# EasyEDA Pro project SCH_DengFOC V3 pro.epro

# Schematic DengFOC V3 pro_2
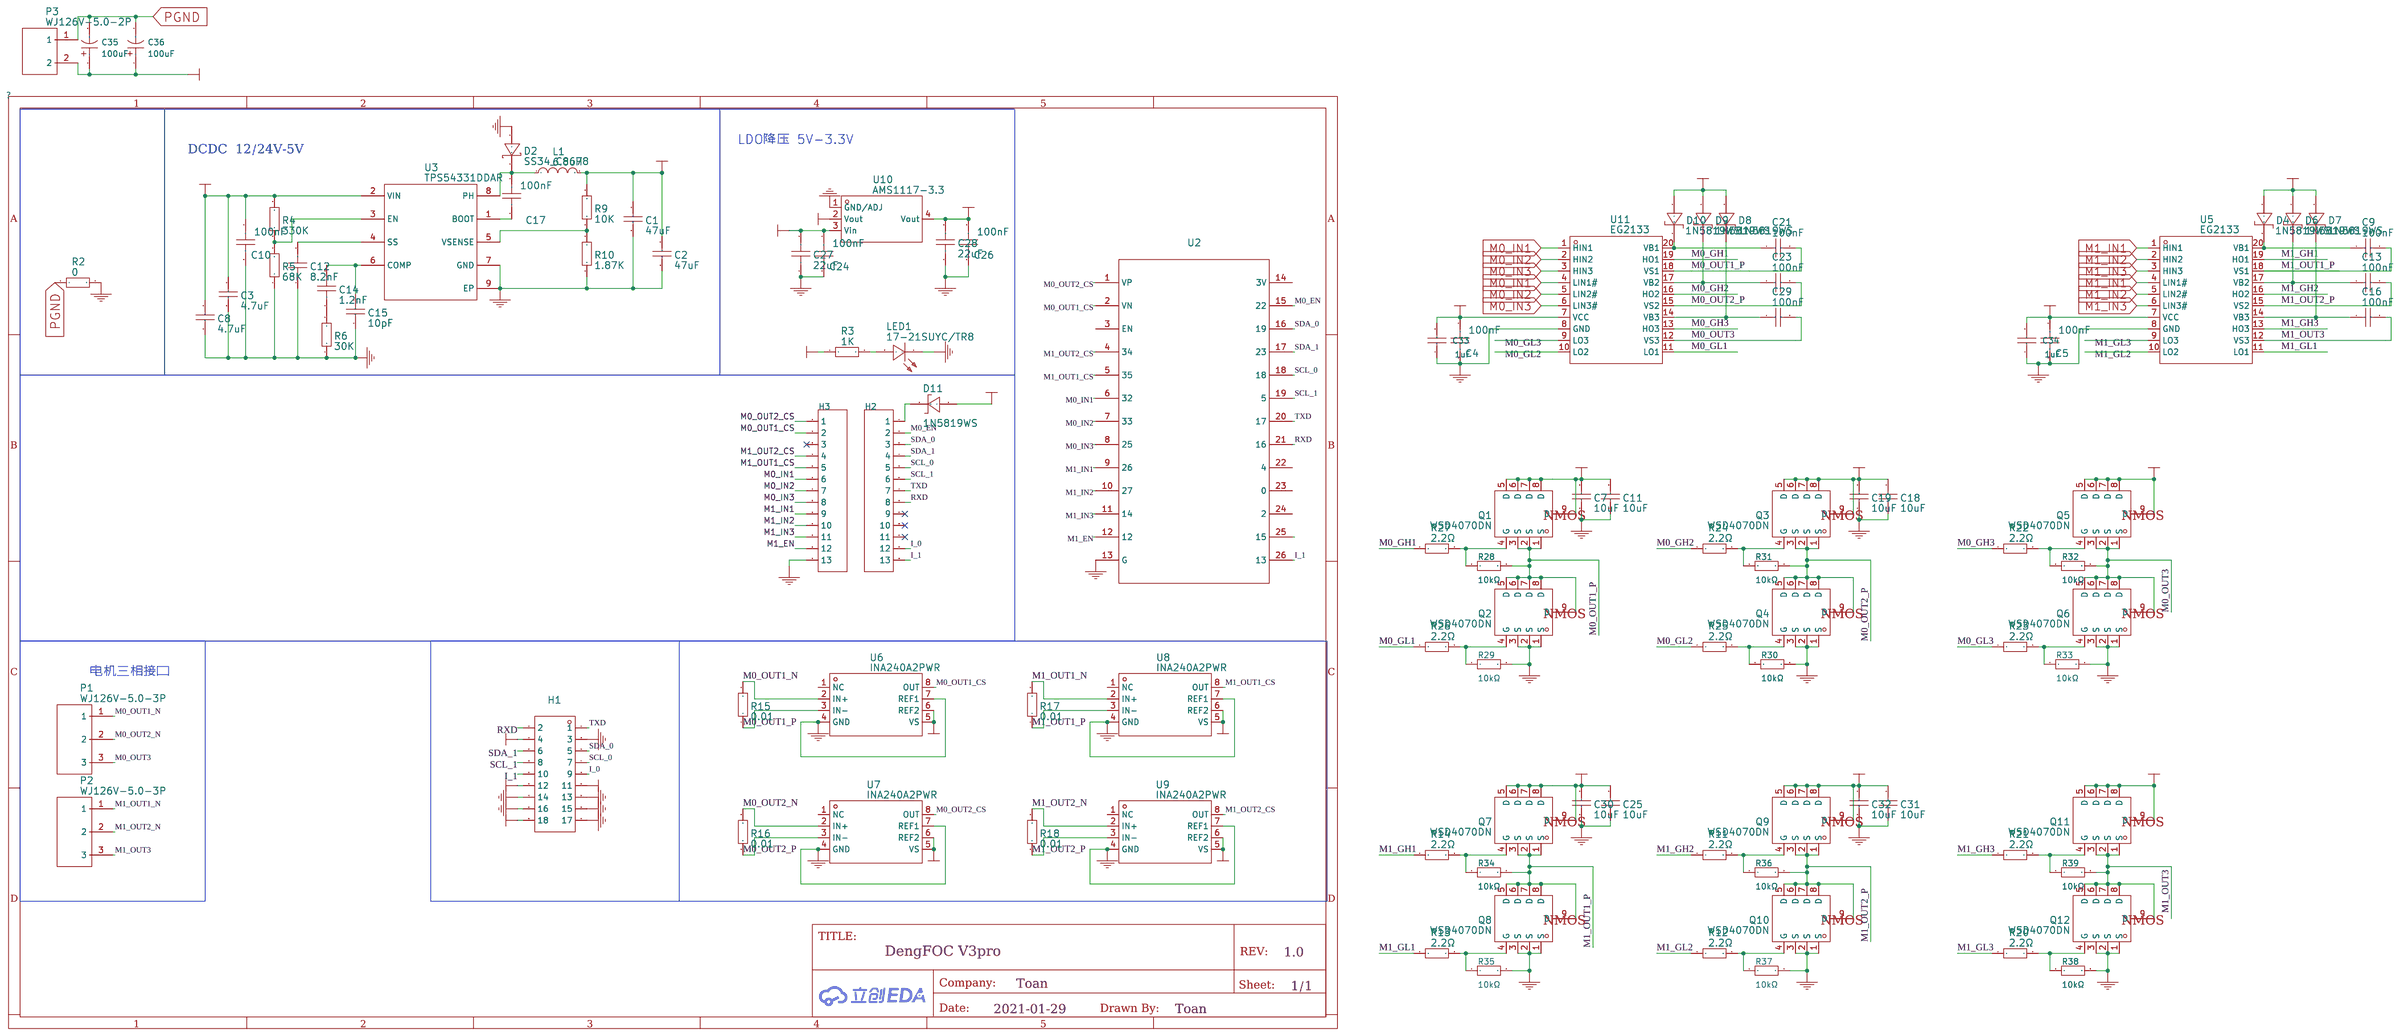
[diagram p0: schematic sheet]

## Parts
C1  47uF  [0603]
C2  47uF  [0603]
C3  4.7uF  [0805]
C4  100nF  [0603]
C5  100nF  [0603]
C7  10uF  [0805]
C8  4.7uF  [0805]
C9  100nF  [0402]
C10  100nF  [0603]
C11  10uF  [0805]
C12  8.2nF  [0603]
C13  100nF  [0402]
C14  1.2nF  [0603]
C15  10pF  [0603]
C16  100nF  [0402]
C17  100nF  [0603]
C18  10uF  [0805]
C19  10uF  [0805]
C21  100nF  [0402]
C23  100nF  [0402]
C24  100nF  [0603]
C25  10uF  [0805]
C26  100nF  [0603]
C27  22uF  [0603]
C28  22uF  [0603]
C29  100nF  [0402]
C30  10uF  [0805]
C31  10uF  [0805]
C32  10uF  [0805]
C33  1uF  [0603]
C34  1uF  [0603]
C35  100uF  [CAP-SMD_BD6.3-L6.6-W6.6-LS7.4-FD]
C36  100uF  [CAP-SMD_BD6.3-L6.6-W6.6-LS7.4-FD]
D2  SS34_C8678  [DO-214AC_L4.3-W2.7-LS5.3-RD]
D4  1N5819WS  [SOD-323_L1.8-W1.3-LS2.5-RD]
D6  1N5819WS  [SOD-323_L1.8-W1.3-LS2.5-RD]
D7  1N5819WS  [SOD-323_L1.8-W1.3-LS2.5-RD]
D8  1N5819WS  [SOD-323_L1.8-W1.3-LS2.5-RD]
D9  1N5819WS  [SOD-323_L1.8-W1.3-LS2.5-RD]
D10  1N5819WS  [SOD-323_L1.8-W1.3-LS2.5-RD]
D11  1N5819WS  [SOD-323_L1.8-W1.3-LS2.5-RD]
H1  Header-Female-2.54_2x9  [HDR-TH_18P-P2.54-V-R2-C9-S2.54]
H2  -  [SMD,P=2.54mm(交错脚)]
H3  -  [SMD,P=2.54mm(交错脚)]
L1  6.8uH  [IND-SMD_L5.0-W5.0_SWPA5040S]
LED1  17-21SUYC/TR8  [LED0805-RD]
P1  WJ126V-5.0-3P  [CONN-TH_3P-P5.00_WJ126V-5.0-3P]
P2  WJ126V-5.0-3P  [CONN-TH_3P-P5.00_WJ126V-5.0-3P]
P3  WJ126V-5.0-2P  [CONN-TH_WJ126V-5.0-2P]
Q1  WSD4070DN  [PDFN3333-8_L3.1-W3.2-P0.65-LS3.4-BL]
Q2  WSD4070DN  [PDFN3333-8_L3.1-W3.2-P0.65-LS3.4-BL]
Q3  WSD4070DN  [PDFN3333-8_L3.1-W3.2-P0.65-LS3.4-BL]
Q4  WSD4070DN  [PDFN3333-8_L3.1-W3.2-P0.65-LS3.4-BL]
Q5  WSD4070DN  [PDFN3333-8_L3.1-W3.2-P0.65-LS3.4-BL]
Q6  WSD4070DN  [PDFN3333-8_L3.1-W3.2-P0.65-LS3.4-BL]
Q7  WSD4070DN  [PDFN3333-8_L3.1-W3.2-P0.65-LS3.4-BL]
Q8  WSD4070DN  [PDFN3333-8_L3.1-W3.2-P0.65-LS3.4-BL]
Q9  WSD4070DN  [PDFN3333-8_L3.1-W3.2-P0.65-LS3.4-BL]
Q10  WSD4070DN  [PDFN3333-8_L3.1-W3.2-P0.65-LS3.4-BL]
Q11  WSD4070DN  [PDFN3333-8_L3.1-W3.2-P0.65-LS3.4-BL]
Q12  WSD4070DN  [PDFN3333-8_L3.1-W3.2-P0.65-LS3.4-BL]
R2  0  [0805]
R3  1K  [0805]
R4  330K  [0603]
R5  68K  [0603]
R6  30K  [0603]
R9  10K  [0603]
R10  1.87K  [0603]
R11  2.2Ω  [0402]
R12  2.2Ω  [0402]
R13  2.2Ω  [0402]
R14  2.2Ω  [0402]
R15  0.01  [R1206]
R16  0.01  [R1206]
R17  0.01  [R1206]
R18  0.01  [R1206]
R20  2.2Ω  [0402]
R21  2.2Ω  [0402]
R22  2.2Ω  [0402]
R23  2.2Ω  [0402]
R24  2.2Ω  [0402]
R25  2.2Ω  [0402]
R26  2.2Ω  [0402]
R27  2.2Ω  [0402]
R28  10kΩ  [R0402]
R29  10kΩ  [R0402]
R30  10kΩ  [R0402]
R31  10kΩ  [R0402]
R32  10kΩ  [R0402]
R33  10kΩ  [R0402]
R34  10kΩ  [R0402]
R35  10kΩ  [R0402]
R36  10kΩ  [R0402]
R37  10kΩ  [R0402]
R38  10kΩ  [R0402]
R39  10kΩ  [R0402]
U2  micropython esp32  [MICROPYTHON ESP32]
U3  TPS54331DDAR  [SOIC-8_L5.0-W4.0-P1.27-LS6.0-BL-EP]
U5  EG2133  [TSSOP-20_L6.5-W4.4-P0.65-LS6.4-BL]
U6  INA240A2PWR  [TSSOP-8_L4.4-W3.0-P0.65-LS6.4-BL]
U7  INA240A2PWR  [TSSOP-8_L4.4-W3.0-P0.65-LS6.4-BL]
U8  INA240A2PWR  [TSSOP-8_L4.4-W3.0-P0.65-LS6.4-BL]
U9  INA240A2PWR  [TSSOP-8_L4.4-W3.0-P0.65-LS6.4-BL]
U10  AMS1117-3.3  [SOT-223-4_L6.5-W3.5-P2.30-LS7.0-BR]
U11  EG2133  [TSSOP-20_L6.5-W4.4-P0.65-LS6.4-BL]

## Library data of the parts
C1 C2 = GRM188R60J476ME15D: Supplier: LCSC; Manufacturer: MuRata; Supplier Part: C140782; JLCPCB Part Class: Extended Part
C3 C8 = CL21A475KBQNNNE: Supplier: LCSC; Manufacturer: SAMSUNG; Supplier Part: C98192; JLCPCB Part Class: Extended Part
C4 C5 C10 C17 C24 C26 = CC0603KRX7R9BB104: Supplier: LCSC; Manufacturer: YAGEO; Supplier Part: C14663; JLCPCB Part Class: Basic; JLCPCB SMD: Yes
C7 C11 C18 C19 C25 C30-C32 = CL21A106KAYNNNE: Supplier: LCSC; Manufacturer: SAMSUNG; Supplier Part: C15850; JLCPCB Part Class: Basic Part
C9 C13 C16 C21 C23 C29 = CL05B104KO5NNNC: Supplier: LCSC; Manufacturer: SAMSUNG; Supplier Part: C1525; JLCPCB Part Class: Basic Part
C12 = CL10B822KB8NNNC: Supplier: LCSC; Manufacturer: SAMSUNG; Supplier Part: C27920; Paste Type: base
C14 = FN18X122K500PSG: Supplier: LCSC; Supplier Part: C565591; Manufacturer: PSA(Prosperity Dielectrics)
C15 = CC0603JRNPO9BN100: Supplier: LCSC; Manufacturer: YAGEO; Supplier Part: C106245; JLCPCB Part Class: Extended Part
C27 C28 = CL10A226MQ8NRNC: Supplier: LCSC; Manufacturer: SAMSUNG; Supplier Part: C59461; Paste Type: base
C33 C34 = CL10A105KB8NNNC: 容值:1uF;精度:±10%;额定电压:50V;材质(温度系数):X5R;; LCSC Part Name: 1uF ±10% 50V; Supplier Part: C15849; Manufacturer: SAMSUNG(三星); JLCPCB Part Class: 基础库; Datasheet: https://atta.szlcsc.com/upload/public/pdf/source/20160103/1457707679084.pdf; Supplier: LCSC; Tolerance: ±10%; Voltage Rated: 50V; Temperature Coefficient: X5R
C35 C36 = RVT100UF35V67RV0034: 容值:100uF;精度:±20%;额定电压:35V;纹波电流:87mA@120kHz;等效串联电阻:-;; LCSC Part Name: 100uF ±20% 35V; Supplier Part: C2836442; Manufacturer: KNSCHA(科尼盛); Supplier Footprint: SMD,D6.3xL7.7mm; JLCPCB Part Class: 扩展库; Datasheet: https://atta.szlcsc.com/upload/public/pdf/source/20210528/C2836442_7F6389BF36F63F32D6DF3A507E8E95D6.pdf; Supplier: LCSC; Tolerance: ±20%; Rated Voltage: 35V; Ripple Current: 87mA@120kHz; φD: 6.3mm; L: 7.7mm; Lifetime @ Temp: 2000hrs@105℃; Operating Temperature: -55℃~+105℃
D2 = SS34: Supplier: LCSC; Manufacturer: MDD; Supplier Part: C8678; JLCPCB Part Class: Basic Part
D4 D6-D11 = 1N5819WS: Supplier: LCSC; Supplier Part: C191023; Manufacturer: Guangdong Hottech; JLCPCB Part Class: Basic Part
H1 = Header-Female-2.54_2x9: Supplier: LCSC; Manufacturer: BOOMELE; Supplier Part: C71956; JLCPCB Part Class: Extended Part
H2 H3 = HDR-F_2.54_1x13P: Supplier Part: C22382478; Supplier Footprint: 贴片
L1 = SWPA5040S6R8M: Supplier: LCSC; Manufacturer: Sunlord; Supplier Part: C36411; JLCPCB Part Class: Extended Part
LED1 = 17-21SUYC/TR8: Supplier: LCSC; Manufacturer: KENTO; image: //image.lceda.cn/szlcsc/C2296.jpg; Supplier Part: C2296; JLCPCB Part Class: Basic
P1 P2 = WJ126V-5.0-3P: Supplier: LCSC; Manufacturer: ReliaPro; Supplier Part: C8401; JLCPCB Part Class: Extended Part
P3 = WJ126V-5.0-2P: Supplier: LCSC; Manufacturer: ReliaPro; Supplier Part: C8404; JLCPCB Part Class: Extended Part
Q1-Q12 = WSD4070DN: Supplier: LCSC; Supplier Part: C719095; Manufacturer: Winsok Semicon; JLCPCB Part Class: Extended Part
R2 = RM10FTN0: Supplier: LCSC; Supplier Part: C254574; Manufacturer: TA-I Tech
R3 = 0805W8F1001T5E: Supplier: LCSC; Manufacturer: UniOhm; Supplier Part: C17513; JLCPCB Part Class: Basic
R4 = 0603WAF3303T5E: Supplier: LCSC; Manufacturer: UniOhm; Supplier Part: C23137; Paste Type: base
R5 = 0603WAF6802T5E: Supplier: LCSC; Manufacturer: UniOhm; Supplier Part: C23231; Paste Type: base
R6 = 0603WAF3002T5E: Supplier: LCSC; Manufacturer: UniOhm; Supplier Part: C22984; JLCPCB Part Class: Basic Part
R9 = 0603WAF1002T5E: Supplier: LCSC; Manufacturer: UniOhm; Supplier Part: C25804; JLCPCB Part Class: Basic Part
R10 = 0603WAF1871T5E: Supplier: LCSC; Manufacturer: UniOhm; Supplier Part: C22850; JLCPCB Part Class: Extended Part
R11-R14 R20-R27 = 0603WAF100JT5E: Supplier: LCSC; Manufacturer: UniOhm; Supplier Part: C25101; Resistance: 10Ω; JLCPCB Part Class: Basic Part
R15-R18 = RTT06R010FTP: Supplier: LCSC; Manufacturer: RALEC; Supplier Part: C104920
R28-R39 = 0402WGF1002TCE: 电阻类型:厚膜电阻;阻值:10kΩ;精度:±1%;功率:62.5mW;; LCSC Part Name: 10kΩ ±1% 62.5mW; Supplier Part: C25744; Manufacturer: UNI-ROYAL(厚声); Supplier Footprint: 0402; JLCPCB Part Class: 基础库; Datasheet: https://atta.szlcsc.com/upload/public/pdf/source/20200306/C422600_1E6D84923E4A46A82E41ADD87F860B5C.pdf; Supplier: LCSC; Type: 厚膜电阻; Tolerance: ±1%; Power(Watts): 62.5mW; Temperature Coefficient: ±100ppm/℃; Overload Voltage (Max): 50V; Operating Temperature Range: -55℃~+155℃
U2 = micropython esp32
U3 = TPS54331DDAR: Supplier: LCSC; Manufacturer: TI; Supplier Part: C90761; JLCPCB Part Class: Extended Part
U5 U11 = EG2133: Supplier: LCSC; Supplier Part: C190343; Manufacturer: EG Micro; JLCPCB Part Class: Extended Part
U6-U9 = INA240A2PWR: Supplier: LCSC; Manufacturer: TI; Supplier Part: C129949; Paste Type: expand
U10 = AMS1117-3.3: Supplier: LCSC; Manufacturer: AMS; image: //image.lceda.cn/szlcsc/C6186.jpg; Supplier Part: C6186; JLCPCB Part Class: Basic; JLCPCB SMD: Yes

## Nets
3V3: C26.1 C28.2 D11.2(A) H1.4 H1.11 H1.12 R3.1 U6.5(VS) U6.6(REF2) U7.5(VS) U7.6(REF2) U8.5(VS) U8.6(REF2) U9.5(VS) U9.6(REF2) U10.2(Vout) U10.4(Vout)
5V: C1.2 C2.2 C4.1 C5.1 C24.1 C27.2 C33.2 C34.2 D4.2(A) D6.2(A) D7.2(A) D8.2(A) D9.2(A) D10.2(A) H1.18 L1.2 R9.2 U5.7(VCC) U10.3(Vin) U11.7(VCC)
GND: C1.1 C2.1 C3.1 C4.2 C5.2 C8.1 C10.2 C12.1 C15.1 C24.2 C26.2 C27.1 C28.1 C33.1 C34.1 D2.2(A) H1.3 H1.13 H1.14 H1.15 H1.16 H1.17 H3.13 LED1.1(-) R2.2 R5.1 R6.1 R10.1 U2.13(G) U3.7(GND) U3.9(EP) U5.8(GND) U6.4(GND) U6.7(REF1) U7.4(GND) U7.7(REF1) U8.4(GND) U8.7(REF1) U9.4(GND) U9.7(REF1) U10.1(GND/ADJ) U11.8(GND)
PGND: C7.1 C11.1 C18.1 C19.1 C25.1 C30.1 C31.1 C32.1 C35.2 C36.2 P3.1 Q2.1(S) Q2.2(S) Q2.3(S) Q4.1(S) Q4.2(S) Q4.3(S) Q6.1(S) Q6.2(S) Q6.3(S) Q8.1(S) Q8.2(S) Q8.3(S) Q10.1(S) Q10.2(S) Q10.3(S) Q12.1(S) Q12.2(S) Q12.3(S) R2.1 R29.2 R30.2 R33.2 R35.2 R37.2 R38.2
VIN: C3.2 C7.2 C8.2 C10.1 C11.2 C18.2 C19.2 C25.2 C30.2 C31.2 C32.2 C35.1 C36.1 P3.2 Q1.5(D) Q1.6(D) Q1.7(D) Q1.8(D) Q1.9(D) Q3.5(D) Q3.6(D) Q3.7(D) Q3.8(D) Q3.9(D) Q5.5(D) Q5.6(D) Q5.7(D) Q5.8(D) Q5.9(D) Q7.5(D) Q7.6(D) Q7.7(D) Q7.8(D) Q7.9(D) Q9.5(D) Q9.6(D) Q9.7(D) Q9.8(D) Q9.9(D) Q11.5(D) Q11.6(D) Q11.7(D) Q11.8(D) Q11.9(D) R4.2 U3.2(VIN)
I_0: H1.9 H2.12
I_1: H1.10 H2.13 U2.26(13)
M0_EN: H2.2 U2.15(22)
M0_GH1: R27.1 U11.19(HO1)
M0_GH2: R24.1 U11.16(HO2)
M0_GH3: R22.1 U11.13(HO3)
M0_GL1: R26.1 U11.11(LO1)
M0_GL2: R25.1 U11.10(LO2)
M0_GL3: R23.1 U11.9(LO3)
M0_IN1: H3.6 U2.6(32) U11.1(HIN1) U11.4(LIN1#)
M0_IN2: H3.7 U2.7(33) U11.2(HIN2) U11.5(LIN2#)
M0_IN3: H3.8 U2.8(25) U11.3(HIN3) U11.6(LIN3#)
M0_OUT1_CS: H3.2 U2.2(VN) U6.8(OUT)
M0_OUT1_N: P1.1 R15.2 U6.2(IN+)
M0_OUT1_P: C21.2 Q1.1(S) Q1.2(S) Q1.3(S) Q2.5(D) Q2.6(D) Q2.7(D) Q2.8(D) Q2.9(D) R15.1 R28.2 U6.3(IN-) U11.18(VS1)
M0_OUT2_CS: H3.1 U2.1(VP) U7.8(OUT)
M0_OUT2_N: P1.2 R16.2 U7.2(IN+)
M0_OUT2_P: C23.2 Q3.1(S) Q3.2(S) Q3.3(S) Q4.5(D) Q4.6(D) Q4.7(D) Q4.8(D) Q4.9(D) R16.1 R31.2 U7.3(IN-) U11.15(VS2)
M0_OUT3: C29.2 P1.3 Q5.1(S) Q5.2(S) Q5.3(S) Q6.5(D) Q6.6(D) Q6.7(D) Q6.8(D) Q6.9(D) R32.2 U11.12(VS3)
M1_EN: H3.12 U2.12
M1_GH1: R14.1 U5.19(HO1)
M1_GH2: R11.1 U5.16(HO2)
M1_GH3: R21.1 U5.13(HO3)
M1_GL1: R13.1 U5.11(LO1)
M1_GL2: R12.1 U5.10(LO2)
M1_GL3: R20.1 U5.9(LO3)
M1_IN1: H3.9 U2.9(26) U5.1(HIN1) U5.4(LIN1#)
M1_IN2: H3.10 U2.10(27) U5.2(HIN2) U5.5(LIN2#)
M1_IN3: H3.11 U2.11(14) U5.3(HIN3) U5.6(LIN3#)
M1_OUT1_CS: H3.5 U2.5(35) U8.8(OUT)
M1_OUT1_N: P2.1 R17.2 U8.2(IN+)
M1_OUT1_P: C9.2 Q7.1(S) Q7.2(S) Q7.3(S) Q8.5(D) Q8.6(D) Q8.7(D) Q8.8(D) Q8.9(D) R17.1 R34.2 U5.18(VS1) U8.3(IN-)
M1_OUT2_CS: H3.4 U2.4(34) U9.8(OUT)
M1_OUT2_N: P2.2 R18.2 U9.2(IN+)
M1_OUT2_P: C13.2 Q9.1(S) Q9.2(S) Q9.3(S) Q10.5(D) Q10.6(D) Q10.7(D) Q10.8(D) Q10.9(D) R18.1 R36.2 U5.15(VS2) U9.3(IN-)
M1_OUT3: C16.2 P2.3 Q11.1(S) Q11.2(S) Q11.3(S) Q12.5(D) Q12.6(D) Q12.7(D) Q12.8(D) Q12.9(D) R39.2 U5.12(VS3)
RXD: H1.2 H2.8 U2.21(16)
SCL_0: H1.7 H2.5 U2.18
SCL_1: H1.8 H2.6 U2.19(5)
SDA_0: H1.5 H2.3 U2.16(19)
SDA_1: H1.6 H2.4 U2.17(23)
TXD: H1.1 H2.7 U2.20(17)
Net-(C9-1): C9.1 D4.1(C) U5.20(VB1)
Net-(C12-2): C12.2 U3.4(SS)
Net-(C13-1): C13.1 D6.1(C) U5.17(VB2)
Net-(C14-1): C14.1 R6.2
Net-(C14-2): C14.2 C15.2 U3.6(COMP)
Net-(C16-1): C16.1 D7.1(C) U5.14(VB3)
Net-(C17-1): C17.1 D2.1(K) L1.1 U3.8(PH)
Net-(C17-2): C17.2 U3.1(BOOT)
Net-(C21-1): C21.1 D10.1(C) U11.20(VB1)
Net-(C23-1): C23.1 D9.1(C) U11.17(VB2)
Net-(C29-1): C29.1 D8.1(C) U11.14(VB3)
Net-(D11-1): D11.1(C) H2.1
Net-(LED1-2): LED1.2(+) R3.2
Net-(Q1-4): Q1.4(G) R27.2 R28.1
Net-(Q2-4): Q2.4(G) R26.2 R29.1
Net-(Q3-4): Q3.4(G) R24.2 R31.1
Net-(Q4-4): Q4.4(G) R25.2 R30.1
Net-(Q5-4): Q5.4(G) R22.2 R32.1
Net-(Q6-4): Q6.4(G) R23.2 R33.1
Net-(Q7-4): Q7.4(G) R14.2 R34.1
Net-(Q8-4): Q8.4(G) R13.2 R35.1
Net-(Q9-4): Q9.4(G) R11.2 R36.1
Net-(Q10-4): Q10.4(G) R12.2 R37.1
Net-(Q11-4): Q11.4(G) R21.2 R39.1
Net-(Q12-4): Q12.4(G) R20.2 R38.1
Net-(R4-1): R4.1 R5.2 U3.3(EN)
Net-(R9-1): R9.1 R10.2 U3.5(VSENSE)

Not connected (* = marked no-connect by the designer): H2 9* 10* 11*; H3 3*; U2 3(EN) 14(3V) 22(4) 23(0) 24(2) 25(15); U6 1(NC); U7 1(NC); U8 1(NC); U9 1(NC)

## Notes on the sheet
- LDO降压 5V-3.3V
- DCDC  12/24V-5V
- 电机三相接口
